# Altium schematic sheet Power.SchDoc
size A4; SheetNumber: 5; SheetTotal: 8
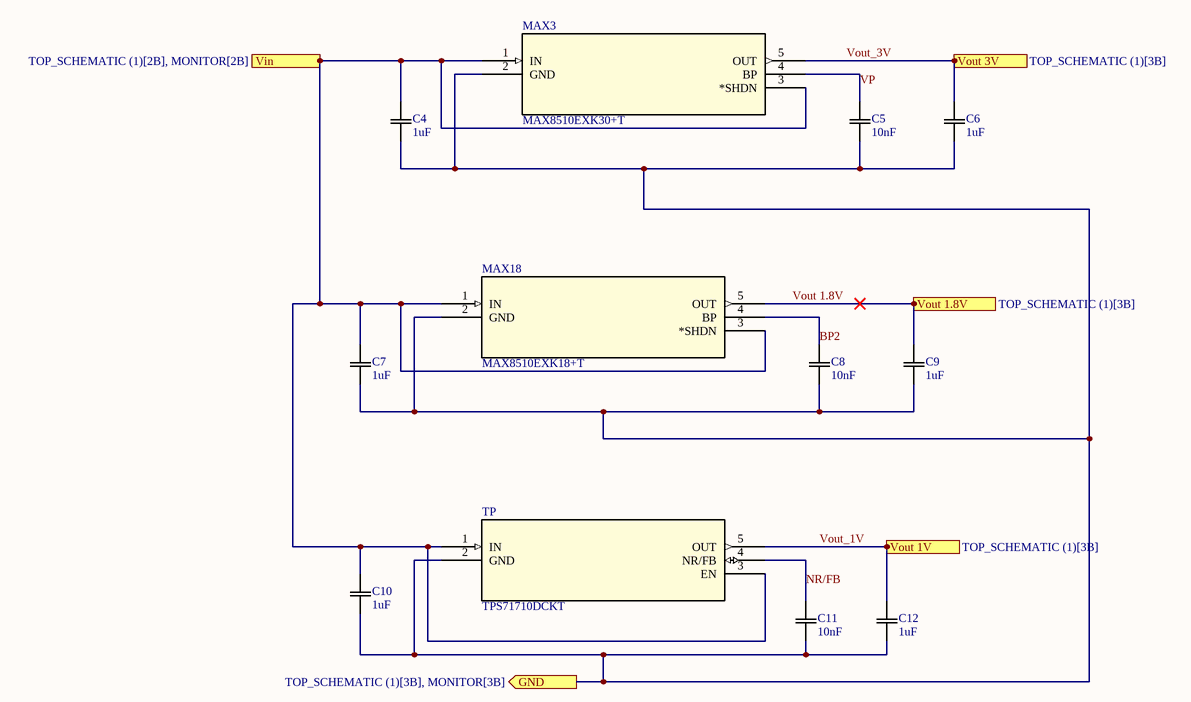
[diagram p0: Power.SchDoc]

## Parts
C4  1uF  [CAP_CL10_SAM]
C5  10nF  [CAP_CL10_SAM]
C6  1uF  [CAP_CL10_SAM]
C7  1uF  [CAP_CL10_SAM]
C8  10nF  [CAP_CL10_SAM]
C9  1uF  [CAP_CL10_SAM]
C10  1uF  [CAP_CL10_SAM]
C11  10nF  [CAP_CL10_SAM]
C12  1uF  [CAP_CL10_SAM]
MAX3  MAX8510EXK30+T  [21-0076E_MXM]
MAX18  MAX8510EXK18+T  [21-0076E_MXM]
TP  TPS71710DCKT  [DCK5]

## Ports
GND (out, see TOP_SCHEMATIC (1)[3B], MONITOR[3B]), Vin (in, see TOP_SCHEMATIC (1)[2B], MONITOR[2B]), Vout 1.8V (see TOP_SCHEMATIC (1)[3B]), Vout 1V (out, see TOP_SCHEMATIC (1)[3B]), Vout 3V (out, see TOP_SCHEMATIC (1)[3B])

## Nets
BP2: C8.2 MAX18.4(BP)
GND: C4.1 C5.1 C6.1 C7.1 C8.1 C9.1 C10.1 C11.1 C12.1 MAX3.2(GND) MAX18.2(GND) TP.2(GND) ; port GND
NR/FB: C11.2 TP.4(NR/FB)
Vin: C4.2 C7.2 C10.2 MAX3.1(IN) MAX3.3(*SHDN) MAX18.1(IN) MAX18.3(*SHDN) TP.1(IN) TP.3(EN) ; port Vin
Vout 1.8V: C9.2 MAX18.5(OUT) ; port Vout 1.8V
Vout_1V: C12.2 TP.5(OUT) ; port Vout 1V
Vout_3V: C6.2 MAX3.5(OUT) ; port Vout 3V
VP: C5.2 MAX3.4(BP)

## Library data of the parts
C4-C12 = CL10C120JB8NNNC: No Description Available; Manufacturer_Name: Samsung; Copyright: Copyright (C) 2026 Ultra Librarian. All rights reserved.; Manufacturer_Part_Number: CL10C120JB8NNNC
MAX3 MAX18 = MAX8510EXK30+T: Ultra-Low-Noise, High PSRR, Low-Dropout, 120mA Linear Regulators; Manufacturer_Name: Analog Devices Inc; Copyright: Copyright (C) 2026 Ultra Librarian. All rights reserved.; Manufacturer_Part_Number: MAX8510EXK30+T; RefDes: RefDes; Type: Type
TP = TPS71710DCKT: 150-mA, high-PSRR, low-IQ, low-dropout voltage regulator with enable 5-SC70 -40 to 125; Manufacturer_Name: Texas Instruments; Copyright: Copyright (C) 2026 Ultra Librarian. All rights reserved.; Manufacturer_Part_Number: TPS71710DCKT; Datasheet: https://www.ti.com/lit/gpn/tps717; RefDes: RefDes; Type: Type